# Altium schematic sheet debug_leds.SchDoc
size A4; SheetNumber: 10; SheetTotal: 10
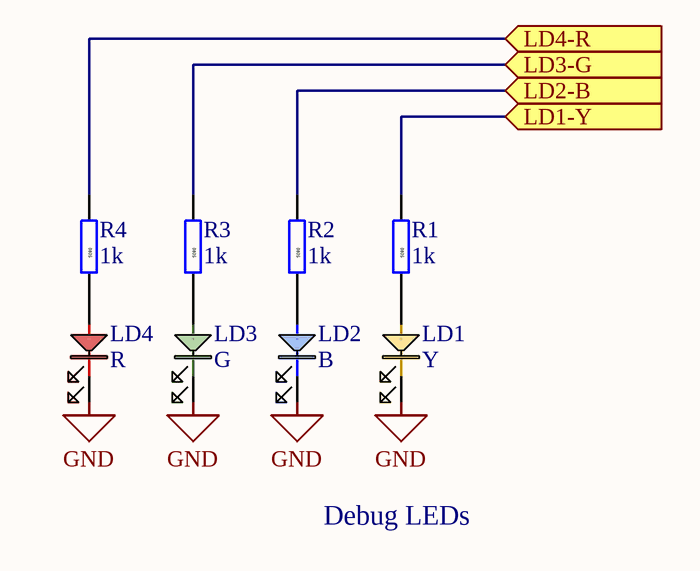
[diagram p0: debug_leds.SchDoc]

## Parts
LD1  Y  [0603_LED_Y]
LD2  B  [0603_LED_B]
LD3  G  [0603_LED_G]
LD4  R  [0603_LED_R]
R1  1k  [RESC2012X06N(SMR0805)]
R2  1k  [RESC2012X06N(SMR0805)]
R3  1k  [RESC2012X06N(SMR0805)]
R4  1k  [RESC2012X06N(SMR0805)]

## Ports
LD1-Y (in), LD2-B (in), LD3-G (in), LD4-R (in)

## Nets
GND: LD1.2 LD2.2 LD3.2 LD4.2
LD1-Y: R1.1 ; port LD1-Y
LD2-B: R2.1 ; port LD2-B
LD3-G: R3.1 ; port LD3-G
LD4-R: R4.1 ; port LD4-R
NetLD1_1: LD1.1 R1.2
NetLD2_1: LD2.1 R2.2
NetLD3_1: LD3.1 R3.2
NetLD4_1: LD4.1 R4.2

## Notes on the sheet
- Debug LEDs

## Library data of the parts
LD1 = LED Y 0603: 0603 Yellow Led; JLCPCB Part: C7496811
LD2 = LED B 0603: 0603 Blue Led; JLCPCB Part: C7496819
LD3 = LED G 0603: 0603 Green Led; JLCPCB Part: C22371297
LD4 = LED R 0603: -40℃~+85℃ Red 0603 LED Indication - Discrete ROHS; JLCPCB Part: C2286
R1-R4 = Res 1k 0805: 125mW Thick Film Resistors 150V ±100ppm/℃ ±1% 1kΩ 0805 Chip Resistor - Surface Mount ROHS; Tolerance & Rating: 1%/0.1W; Basic: Yes; Value: 1k; Package: 0805; Author: JP/27.03.2014; SMD: 1; ComponentLink3Description: rezistor čip; ComponentLink3URL: heliosgreen://v1/hegMT/5-MT/Classes(343)/Folders/OpenForm?RecordNumbers=[381513]; JLCPCB Part: C17513